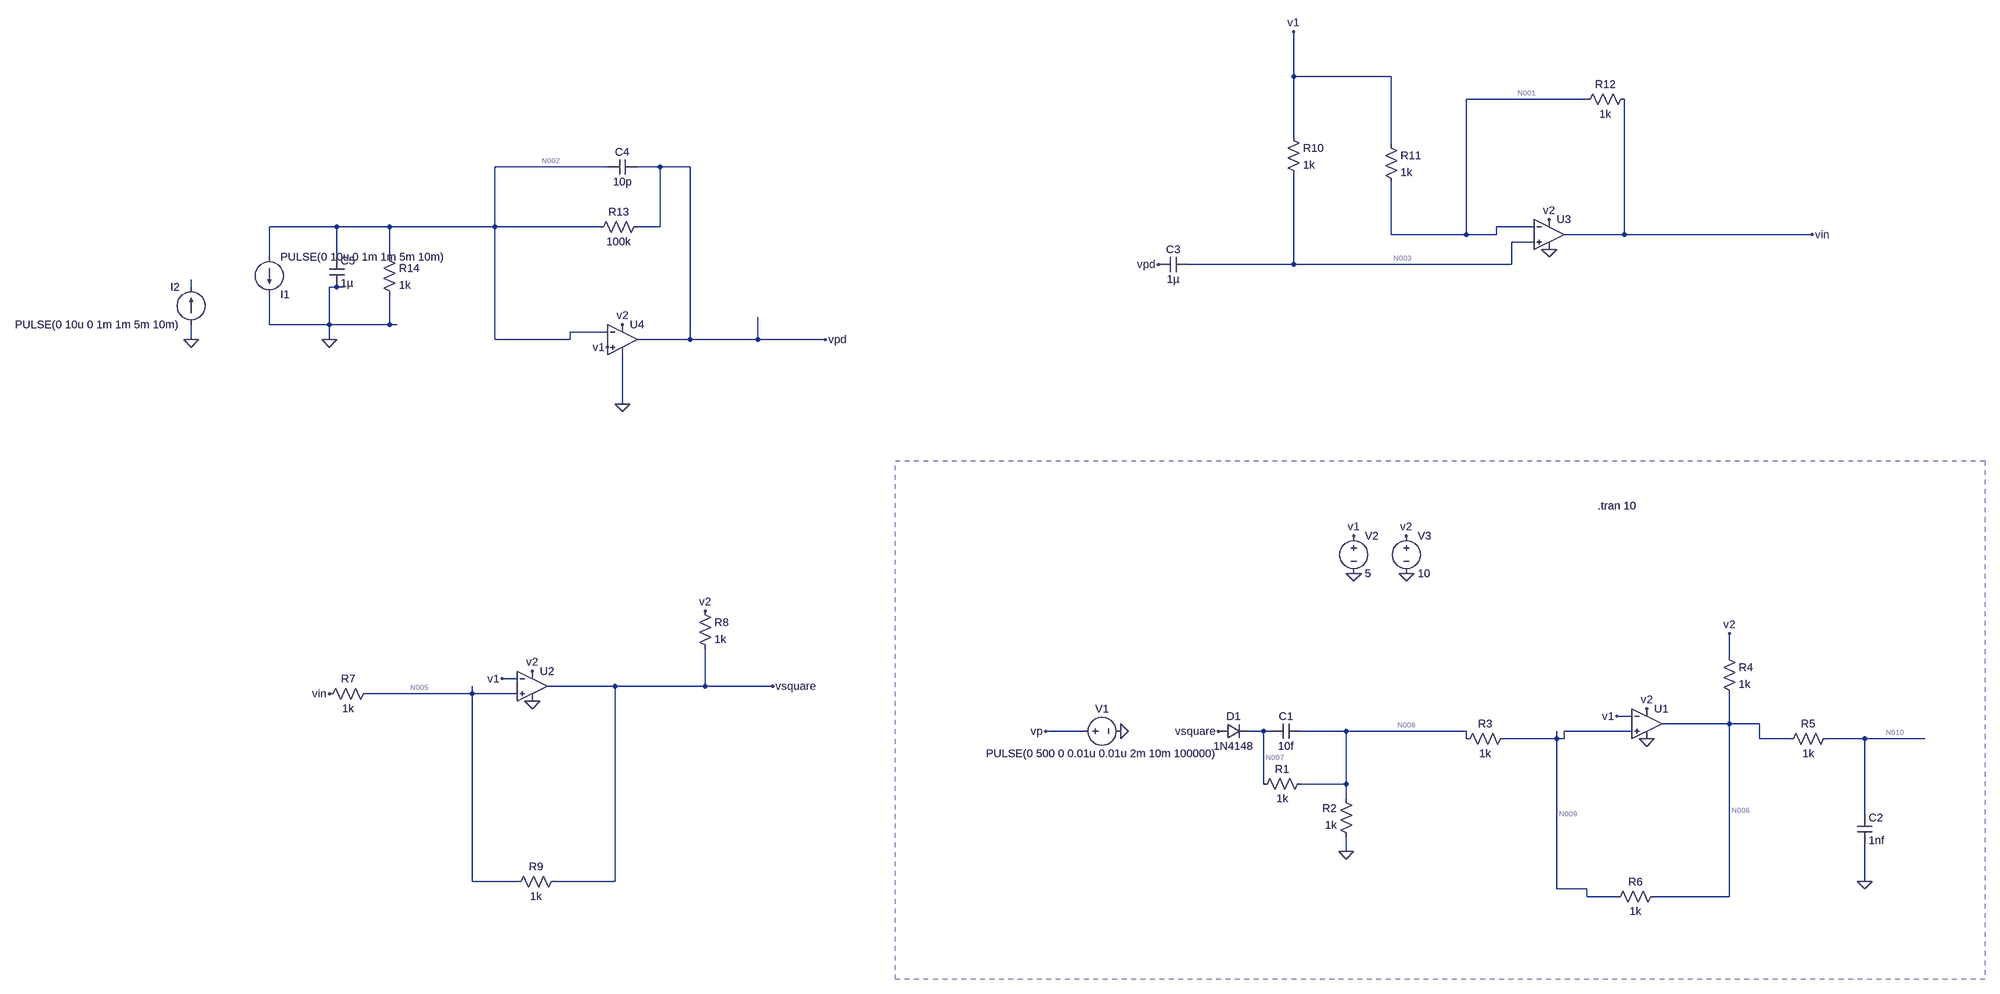
[diagram p0: schematic Draft for receiver.asc]
Draft for receiver.asc, the LTspice schematic file:
Version 4.1
SHEET 1 1700 680
WIRE 224 -1712 224 -1808
WIRE 432 -1712 224 -1712
WIRE 848 -1664 592 -1664
WIRE 224 -1584 224 -1712
WIRE 432 -1568 432 -1712
WIRE -1952 -1520 -2192 -1520
WIRE -1840 -1520 -1888 -1520
WIRE -1776 -1520 -1840 -1520
WIRE -2528 -1392 -2672 -1392
WIRE -2416 -1392 -2528 -1392
WIRE -2192 -1392 -2192 -1520
WIRE -2192 -1392 -2416 -1392
WIRE -1968 -1392 -2192 -1392
WIRE -1840 -1392 -1840 -1520
WIRE -1840 -1392 -1888 -1392
WIRE 736 -1392 656 -1392
WIRE 432 -1376 432 -1488
WIRE 592 -1376 592 -1664
WIRE 592 -1376 432 -1376
WIRE 656 -1376 656 -1392
WIRE 656 -1376 592 -1376
WIRE 928 -1376 928 -1664
WIRE 928 -1376 800 -1376
WIRE 1328 -1376 928 -1376
WIRE 736 -1360 688 -1360
WIRE -2672 -1328 -2672 -1392
WIRE -2528 -1328 -2528 -1392
WIRE -2416 -1328 -2416 -1392
WIRE 224 -1312 224 -1504
WIRE 224 -1312 0 -1312
WIRE 688 -1312 688 -1360
WIRE 688 -1312 224 -1312
WIRE -3120 -1264 -3120 -1280
WIRE -2528 -1264 -2544 -1264
WIRE -2512 -1264 -2528 -1264
WIRE -2672 -1184 -2672 -1248
WIRE -2544 -1184 -2544 -1264
WIRE -2544 -1184 -2672 -1184
WIRE -2416 -1184 -2416 -1248
WIRE -2416 -1184 -2544 -1184
WIRE -2400 -1184 -2416 -1184
WIRE -1952 -1168 -2032 -1168
WIRE -3120 -1152 -3120 -1184
WIRE -2544 -1152 -2544 -1184
WIRE -2192 -1152 -2192 -1392
WIRE -2032 -1152 -2032 -1168
WIRE -2032 -1152 -2192 -1152
WIRE -1776 -1152 -1776 -1520
WIRE -1776 -1152 -1888 -1152
WIRE -1632 -1152 -1632 -1200
WIRE -1632 -1152 -1776 -1152
WIRE -1488 -1152 -1632 -1152
WIRE -1920 -1008 -1920 -1120
WIRE 1152 -368 1152 -416
WIRE -2144 -320 -2176 -320
WIRE -1936 -304 -2080 -304
WIRE -1744 -304 -1744 -384
WIRE -1744 -304 -1936 -304
WIRE -1600 -304 -1744 -304
WIRE -2240 -288 -2240 -304
WIRE -2240 -288 -2464 -288
WIRE -2144 -288 -2240 -288
WIRE 944 -240 912 -240
WIRE 1152 -224 1152 -288
WIRE 1152 -224 1008 -224
WIRE 1216 -224 1152 -224
WIRE -224 -208 -304 -208
WIRE 80 -208 64 -208
WIRE 160 -208 128 -208
WIRE 176 -208 160 -208
WIRE 336 -208 240 -208
WIRE 592 -208 336 -208
WIRE 944 -208 800 -208
WIRE 592 -192 592 -208
WIRE 784 -192 784 -208
WIRE 784 -192 672 -192
WIRE 800 -192 800 -208
WIRE 800 -192 784 -192
WIRE 1216 -192 1216 -224
WIRE 1280 -192 1216 -192
WIRE 1440 -192 1360 -192
WIRE 1568 -192 1440 -192
WIRE 160 -96 160 -208
WIRE 336 -96 336 -208
WIRE 336 -96 240 -96
WIRE 336 -64 336 -96
WIRE 1440 -32 1440 -192
WIRE 336 48 336 16
WIRE -2240 112 -2240 -288
WIRE -2144 112 -2240 112
WIRE -1936 112 -1936 -304
WIRE -1936 112 -2064 112
WIRE 1440 112 1440 32
WIRE 784 128 784 -192
WIRE 848 128 784 128
WIRE 848 144 848 128
WIRE 912 144 848 144
WIRE 1152 144 1152 -224
WIRE 1152 144 992 144
FLAG 336 48 0
FLAG 1440 112 0
FLAG 1152 -416 v2
FLAG 976 -192 0
FLAG 976 -256 v2
FLAG 912 -240 v1
FLAG 352 -544 0
FLAG 464 -544 0
FLAG 352 -624 v1
FLAG 464 -624 v2
FLAG -304 -208 vp
FLAG -144 -208 0
FLAG -2112 -272 0
FLAG -2112 -336 v2
FLAG -1744 -464 v2
FLAG -2176 -320 v1
FLAG -1920 -1008 0
FLAG -1920 -1184 v2
FLAG -1952 -1136 v1
FLAG 768 -1408 v2
FLAG 224 -1808 v1
FLAG 768 -1344 0
FLAG 1328 -1376 vin
FLAG -64 -1312 vpd
FLAG -1488 -1152 vpd
FLAG -2544 -288 vin
FLAG -1600 -304 vsquare
FLAG 64 -208 vsquare
FLAG -3120 -1152 0
FLAG -2544 -1152 0
DATAFLAG -2544 -1184 ""
DATAFLAG -2528 -1392 ""
SYMBOL diode 64 -192 R270
WINDOW 0 32 32 VTop 2
WINDOW 3 0 32 VBottom 2
SYMATTR InstName D1
SYMATTR Value 1N4148
SYMBOL cap 240 -224 R90
WINDOW 0 0 32 VBottom 2
WINDOW 3 32 32 VTop 2
SYMATTR InstName C1
SYMATTR Value 10f
SYMBOL res 256 -112 R90
WINDOW 0 0 56 VBottom 2
WINDOW 3 32 56 VTop 2
SYMATTR InstName R1
SYMATTR Value 1k
SYMBOL res 352 32 R180
WINDOW 0 36 76 Left 2
WINDOW 3 36 40 Left 2
SYMATTR InstName R2
SYMATTR Value 1k
SYMBOL voltage -240 -208 R270
WINDOW 0 32 56 VTop 2
WINDOW 3 -32 56 VBottom 2
WINDOW 123 0 0 Left 0
WINDOW 39 0 0 Left 0
SYMATTR InstName V1
SYMATTR Value PULSE(0 500 0 0.01u 0.01u 2m 10m 100000)
SYMBOL res 688 -208 R90
WINDOW 0 0 56 VBottom 2
WINDOW 3 32 56 VTop 2
SYMATTR InstName R3
SYMATTR Value 1k
SYMBOL OpAmps\\UniversalOpAmp2 976 -224 R0
SYMATTR InstName U1
SYMBOL res 1136 -384 R0
SYMATTR InstName R4
SYMATTR Value 1k
SYMBOL res 1376 -208 R90
WINDOW 0 0 56 VBottom 2
WINDOW 3 32 56 VTop 2
SYMATTR InstName R5
SYMATTR Value 1k
SYMBOL cap 1424 -32 R0
SYMATTR InstName C2
SYMATTR Value 1nf
SYMBOL res 1008 128 R90
WINDOW 0 0 56 VBottom 2
WINDOW 3 32 56 VTop 2
SYMATTR InstName R6
SYMATTR Value 1k
SYMBOL voltage 352 -640 R0
WINDOW 123 0 0 Left 0
WINDOW 39 0 0 Left 0
SYMATTR InstName V2
SYMATTR Value 5
SYMBOL voltage 464 -640 R0
WINDOW 123 0 0 Left 0
WINDOW 39 0 0 Left 0
SYMATTR InstName V3
SYMATTR Value 10
SYMBOL res -2448 -304 R90
WINDOW 0 0 56 VBottom 2
WINDOW 3 32 56 VTop 2
SYMATTR InstName R7
SYMATTR Value 1k
SYMBOL OpAmps\\UniversalOpAmp2 -2112 -304 R0
SYMATTR InstName U2
SYMBOL res -1760 -480 R0
SYMATTR InstName R8
SYMATTR Value 1k
SYMBOL res -2048 96 R90
WINDOW 0 0 56 VBottom 2
WINDOW 3 32 56 VTop 2
SYMATTR InstName R9
SYMATTR Value 1k
SYMBOL res 208 -1600 R0
SYMATTR InstName R10
SYMATTR Value 1k
SYMBOL res 416 -1584 R0
SYMATTR InstName R11
SYMATTR Value 1k
SYMBOL res 944 -1680 R90
WINDOW 0 0 56 VBottom 2
WINDOW 3 32 56 VTop 2
SYMATTR InstName R12
SYMATTR Value 1k
SYMBOL OpAmps\\UniversalOpAmp2 768 -1376 R0
SYMATTR InstName U3
SYMBOL cap 0 -1328 R90
WINDOW 0 0 32 VBottom 2
WINDOW 3 32 32 VTop 2
SYMATTR InstName C3
SYMATTR Value 1µ
SYMBOL OpAmps\\UniversalOpAmp2 -1920 -1152 R0
SYMATTR InstName U4
SYMBOL res -1872 -1408 R90
WINDOW 0 0 56 VBottom 2
WINDOW 3 32 56 VTop 2
SYMATTR InstName R13
SYMATTR Value 100k
SYMBOL cap -1888 -1536 R90
WINDOW 0 0 32 VBottom 2
WINDOW 3 32 32 VTop 2
SYMATTR InstName C4
SYMATTR Value 10p
SYMBOL current -3120 -1184 R180
WINDOW 0 24 80 Left 2
WINDOW 3 24 0 Left 2
WINDOW 123 0 0 Left 0
WINDOW 39 0 0 Left 0
SYMATTR InstName I2
SYMATTR Value PULSE(0 10u 0 1m 1m 5m 10m)
SYMBOL res -2432 -1344 R0
SYMATTR InstName R14
SYMATTR Value 1k
SYMBOL cap -2544 -1328 R0
SYMATTR InstName C5
SYMATTR Value 1µ
SYMBOL current -2672 -1328 R0
WINDOW 0 24 80 Left 2
WINDOW 3 24 0 Left 2
WINDOW 123 0 0 Left 0
WINDOW 39 0 0 Left 0
SYMATTR InstName I1
SYMATTR Value PULSE(0 10u 0 1m 1m 5m 10m)
TEXT 872 -688 Left 2 !.tran 10
RECTANGLE Normal 1696 320 -624 -784 2

The netlist it stands for:
* Draft for receiver.asc
D1 vsquare N007 1N4148
C1 N008 N007 10f
R1 N008 N007 1k
R2 0 N008 1k
V1 vp 0 PULSE(0 500 0 0.01u 0.01u 2m 10m 100000)
R3 N009 N008 1k
X§U1 N009 v1 v2 0 N006 level2 Avol=1Meg GBW=10Meg Slew=10Meg Ilimit=25m Rail=0 Vos=0 En=0 Enk=0 In=0 Ink=0 Rin=500Meg  ; pins In+ In- V+ V- OUT
R4 v2 N006 1k
R5 N010 N006 1k
C2 N010 0 1nf
R6 N006 N009 1k
V2 v1 0 5
V3 v2 0 10
R7 N005 vin 1k
X§U2 N005 v1 v2 0 vsquare level2 Avol=1Meg GBW=10Meg Slew=10Meg Ilimit=25m Rail=0 Vos=0 En=0 Enk=0 In=0 Ink=0 Rin=500Meg  ; pins In+ In- V+ V- OUT
R8 v2 vsquare 1k
R9 vsquare N005 1k
R10 v1 N003 1k
R11 v1 N001 1k
R12 vin N001 1k
X§U3 N003 N001 v2 0 vin level2 Avol=1Meg GBW=10Meg Slew=10Meg Ilimit=25m Rail=0 Vos=0 En=0 Enk=0 In=0 Ink=0 Rin=500Meg  ; pins In+ In- V+ V- OUT
C3 N003 vpd 1µ
X§U4 v1 N002 v2 0 vpd level2 Avol=1Meg GBW=10Meg Slew=10Meg Ilimit=25m Rail=0 Vos=0 En=0 Enk=0 In=0 Ink=0 Rin=500Meg  ; pins In+ In- V+ V- OUT
R13 vpd N002 100k
C4 vpd N002 10p
I2 0 N004 PULSE(0 10u 0 1m 1m 5m 10m)
R14 N002 0 1k
C5 N002 0 1µ
I1 N002 0 PULSE(0 10u 0 1m 1m 5m 10m)
.model D D
.lib standard.dio
.tran 10
.lib UniversalOpAmp2.lib
.backanno
.end

* Results of the author's LTspice run, read from the files saved beside the schematic
* Operating Point, zero values left out:
*   V(n001) = 5 V
*   V(n002) = 99.01 mV
*   V(n003) = 5 V
*   V(n005) = 2.57 V
*   V(n006) = 107.9 mV
*   V(n007) = 36.01 mV
*   V(n008) = 35.99 mV
*   V(n009) = 71.95 mV
*   V(n010) = 107.9 mV
*   V(v1) = 5 V
*   V(v2) = 10 V
*   V(vin) = 5 V
*   V(vpd) = 9.999 V
*   V(vsquare) = 139.3 mV
*   I(D1) = 22.11 nA
*   I(R1) = -22.11 nA
*   I(R11) = 39.22 pA
*   I(R12) = -39.22 pA
*   I(R13) = 99 µA
*   I(R14) = 99.01 µA
*   I(R2) = -35.99 µA
*   I(R3) = 35.96 µA
*   I(R4) = 9.892 mA
*   I(R6) = 35.95 µA
*   I(R7) = -2.43 mA
*   I(R8) = 9.861 mA
*   I(R9) = -2.43 mA
*   I(V2) = -39.22 pA
*   I(V3) = -22.38 mA